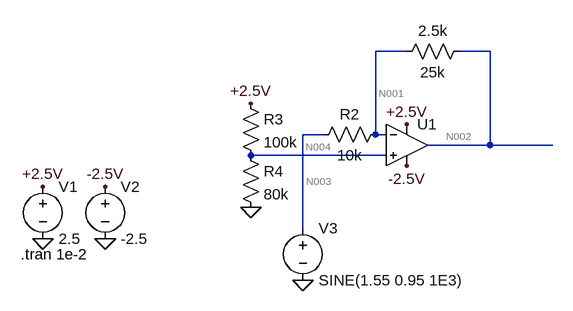
[diagram p0: schematic Draft3.asc]
Draft3.asc, the LTspice schematic file:
Version 4
SHEET 1 880 680
WIRE 480 -48 432 -48
WIRE 608 -48 560 -48
WIRE 352 80 320 80
WIRE 432 80 432 -48
WIRE 448 80 432 80
WIRE 608 96 608 -48
WIRE 608 96 512 96
WIRE 704 96 608 96
WIRE 448 112 240 112
WIRE 320 224 320 80
FLAG -80 240 0
FLAG 16 240 0
FLAG -80 160 +2.5V
FLAG 16 160 -2.5V
FLAG 320 304 0
FLAG 480 64 +2.5V
FLAG 480 128 -2.5V
FLAG 240 192 0
FLAG 240 32 +2.5V
SYMBOL voltage -80 144 R0
WINDOW 123 0 0 Left 2
WINDOW 39 0 0 Left 2
SYMATTR InstName V1
SYMATTR Value 2.5
SYMBOL voltage 16 144 R0
WINDOW 123 0 0 Left 2
WINDOW 39 0 0 Left 2
SYMATTR InstName V2
SYMATTR Value -2.5
SYMBOL voltage 320 208 R0
WINDOW 123 0 0 Left 2
WINDOW 39 0 0 Left 2
SYMATTR InstName V3
SYMATTR Value SINE(1.55 0.95 1E3)
SYMBOL Opamps\\UniversalOpamp2 480 96 R0
SYMATTR InstName U1
SYMBOL res 576 -64 R90
WINDOW 0 0 56 VBottom 2
WINDOW 3 32 56 VTop 2
SYMATTR InstName 2.5k
SYMATTR Value 25k
SYMBOL res 448 64 R90
WINDOW 0 0 56 VBottom 2
WINDOW 3 32 56 VTop 2
SYMATTR InstName R2
SYMATTR Value 10k
SYMBOL res 224 16 R0
SYMATTR InstName R3
SYMATTR Value 100k
SYMBOL res 224 96 R0
SYMATTR InstName R4
SYMATTR Value 80k
TEXT -114 264 Left 2 !.tran 1e-2

The netlist it stands for:
* Draft3.asc
V1 +2.5V 0 2.5
V2 -2.5V 0 -2.5
V3 N003 0 SINE(1.55 0.95 1E3)
XU1 N004 N001 +2.5V -2.5V N002 level.2 Avol=1Meg GBW=10Meg Slew=10Meg ilimit=25m rail=0 Vos=0 phimargin=45 en=0 enk=0 in=0 ink=0 Rin=500Meg  ; pins IN+ IN- V+ V- OUT
R§2.5k N002 N001 25k
R2 N001 N003 10k
R3 +2.5V N004 100k
R4 N004 0 80k
.tran 1e-2
.lib UniversalOpamps2.sub
.backanno
.end

* Results of the author's LTspice run, read from the files saved beside the schematic
* Operating Point, zero values left out:
*   V(+2.5v) = 2.5 V
*   V(-2.5v) = -2.5 V
*   V(n003) = 1.55 V
*   V(n002) = 13.6 mV
*   V(n001) = 1.111 V
*   V(n004) = 1.111 V
*   I(R4) = 13.89 µA
*   I(R3) = 13.89 µA
*   I(R2) = -43.9 µA
*   I(2.5k) = -43.9 µA
*   I(V3) = -43.9 µA
*   I(V2) = 272.9 µA
*   I(V1) = -242.9 µA
*   Ix(u1:1) = 2.222 nA
*   Ix(u1:2) = 2.222 nA
*   Ix(u1:3) = 229 µA
*   Ix(u1:4) = -272.9 µA
*   Ix(u1:5) = 43.9 µA
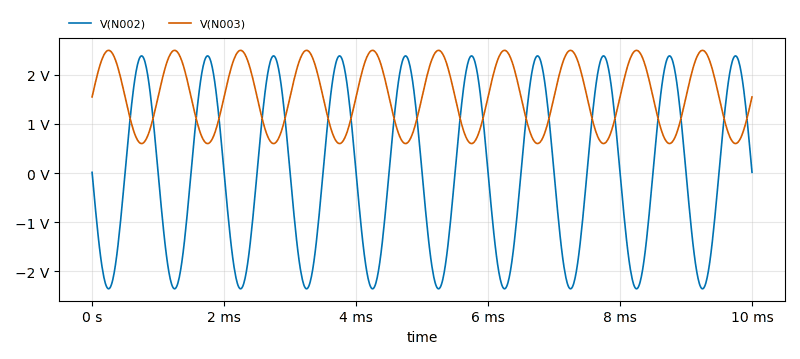
[diagram p1: Transient Analysis of Draft3.asc, plotted from the saved traces]
* Transient Analysis, 1 run:
*   V(N002): min -2.359 V, max 2.386 V, average 13.97 mV, rms 1.678 V, last 14.44 mV
*   V(N003): min 600.9 mV, max 2.499 V, average 1.55 V, rms 1.689 V, last 1.55 V